# Altium schematic sheet PD_v3.SchDoc
size A4; SheetNumber: 1; SheetTotal: 1
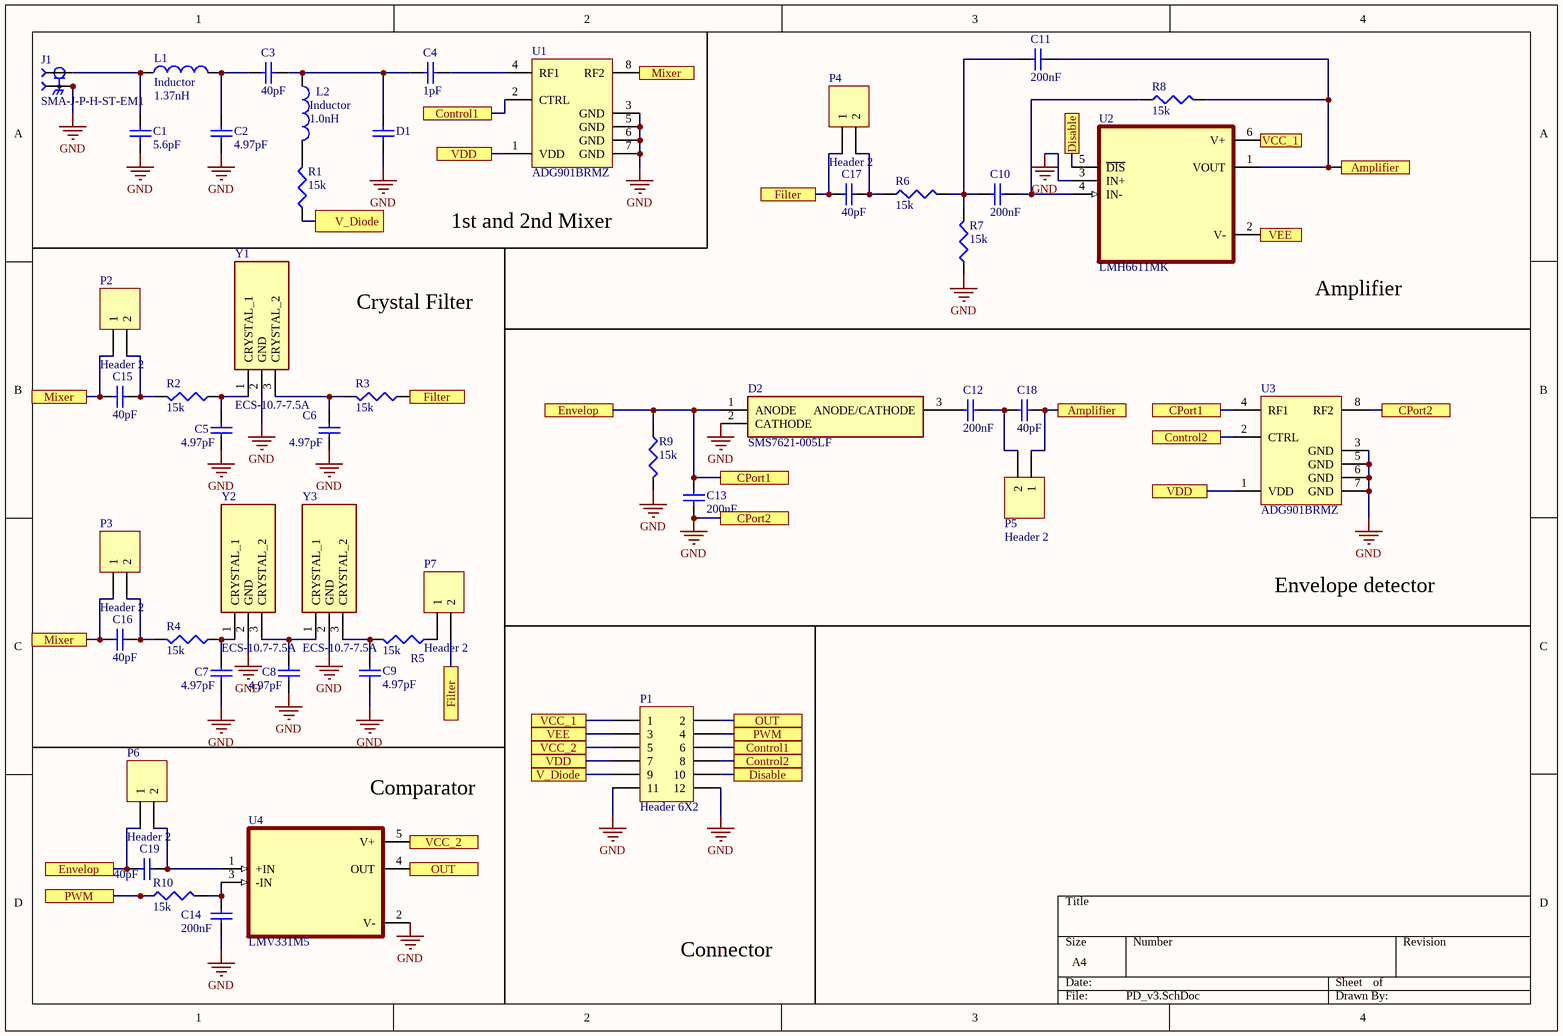
[diagram p0: PD_v3.SchDoc]

## Parts
C1  value 5.6pF  [6-0805_N]  (hidden comment: 陶瓷电容)
C2  value 4.97pF  [6-0805_N]  (hidden comment: 陶瓷电容)
C3  value 40pF  [6-0805_N]  (hidden comment: 陶瓷电容)
C4  value 1pF  [6-0805_N]  (hidden comment: 陶瓷电容)
C5  value 4.97pF  [6-0805_N]  (hidden comment: 陶瓷电容)
C6  value 4.97pF  [6-0805_N]  (hidden comment: 陶瓷电容)
C7  value 4.97pF  [6-0805_N]  (hidden comment: 陶瓷电容)
C8  value 4.97pF  [6-0805_N]  (hidden comment: 陶瓷电容)
C9  value 4.97pF  [6-0805_N]  (hidden comment: 陶瓷电容)
C10  value 200nF  [6-0805_N]  (hidden comment: 陶瓷电容)
C11  value 200nF  [6-0805_N]  (hidden comment: 陶瓷电容)
C12  value 200nF  [6-0805_N]  (hidden comment: 陶瓷电容)
C13  value 200nF  [6-0805_N]  (hidden comment: 陶瓷电容)
C14  value 200nF  [6-0805_N]  (hidden comment: 陶瓷电容)
C15  value 40pF  [0603]  (hidden comment: 陶瓷电容)
C16  value 40pF  [0603]  (hidden comment: 陶瓷电容)
C17  value 40pF  [0603]  (hidden comment: 陶瓷电容)
C18  value 40pF  [0603]  (hidden comment: 陶瓷电容)
C19  value 40pF  [0603]  (hidden comment: 陶瓷电容)
D1  陶瓷电容  [6-0805_N]  (value not drawn)
D2  SMS7621-005LF  [SOT95P237X112-3N]
J1  SMA-J-P-H-ST-EM1  [SAMTEC_SMA-J-P-H-ST-EM1]
L1  Inductor  value 1.37nH  [6-0805_N]
L2  Inductor  value 1.0nH  [6-0805_N]
P1  Header 6X2  [HDR2X6]
P2  Header 2  [HDR1X2]
P3  Header 2  [HDR1X2]
P4  Header 2  [HDR1X2]
P5  Header 2  [HDR1X2]
P6  Header 2  [HDR1X2]
P7  Header 2  [HDR1X2]
R1  value 15k  [6-0805_N]  (hidden comment: 电阻)
R2  value 15k  [6-0805_N]  (hidden comment: 电阻)
R3  value 15k  [6-0805_N]  (hidden comment: 电阻)
R4  value 15k  [6-0805_N]  (hidden comment: 电阻)
R5  value 15k  [6-0805_N]  (hidden comment: 电阻)
R6  value 15k  [6-0805_N]  (hidden comment: 电阻)
R7  value 15k  [6-0805_N]  (hidden comment: 电阻)
R8  value 15k  [6-0805_N]  (hidden comment: 电阻)
R9  value 15k  [6-0805_N]  (hidden comment: 电阻)
R10  value 15k  [6-0805_N]  (hidden comment: 电阻)
U1  ADG901BRMZ  [SOP65P490X110-8N]
U2  LMH6611MK  [SOT95P280X110-6N]
U3  ADG901BRMZ  [SOP65P490X110-8N]
U4  LMV331M5  [SOT95P280X145-5N]
Y1  ECS-10.7-7.5A  [ECS10775A]
Y2  ECS-10.7-7.5A  [ECS10775A]
Y3  ECS-10.7-7.5A  [ECS10775A]

## Ports
Amplifier, Control1, Control2, CPort1, CPort2, Disable, Envelop, Filter, Mixer, OUT, PWM, V_Diode, VCC_1, VCC_2, VDD, VEE

## Nets
GND: C1.1 C2.1 C5.1 C6.1 C7.1 C8.1 C9.1 C13.2 C14.2 D1.1 D2.2(CATHODE) J1.2_1 J1.2_2 J1.3_1 J1.3_2 P1.11 P1.12 R7.1 R9.1 U1.3(GND) U1.5(GND) U1.6(GND) U1.7(GND) U2.3(IN+) U3.3(GND) U3.5(GND) U3.6(GND) U3.7(GND) U3.8(RF2) U4.2(V-) Y1.2(GND) Y2.2(GND) Y3.2(GND) ; port CPort2
Amplifier: C11.2 C18.2 P5.1 R8.2 U2.1(VOUT) ; port Amplifier
Control1: P1.6 U1.2(CTRL) ; port Control1
Control2: P1.8 U3.2(CTRL) ; port Control2
CPort1: C13.1 C19.1 D2.1(ANODE) P6.1 R9.2 U3.4(RF1) ; port CPort1, port Envelop
Disable: P1.10 U2.5(~{DIS}) ; port Disable
Filter: C17.1 P4.1 P7.2 R3.1 ; port Filter
Mixer: C15.1 C16.1 P2.1 P3.1 U1.8(RF2) ; port Mixer
OUT: P1.2 U4.4(OUT) ; port OUT
PWM: P1.4 R10.2 ; port PWM
V_Diode: P1.9 R1.1 ; port V_Diode
VCC_1: P1.1 U2.6(V+) ; port VCC_1
VCC_2: P1.5 U4.5(V+) ; port VCC_2
VDD: P1.7 U1.1(VDD) U3.1(VDD) ; port VDD
VEE: P1.3 U2.2(V-) ; port VEE
NetC1_2: C1.2 J1.1 L1.1
NetC2_2: C2.2 C3.1 L1.2
NetC3_2: C3.2 C4.1 D1.2 L2.1
NetC4_2: C4.2 U1.4(RF1)
NetC5_2: C5.2 R2.1 Y1.1(CRYSTAL_1)
NetC6_2: C6.2 R3.2 Y1.3(CRYSTAL_2)
NetC7_2: C7.2 R4.1 Y2.1(CRYSTAL_1)
NetC8_2: C8.2 Y2.3(CRYSTAL_2) Y3.1(CRYSTAL_1)
NetC9_2: C9.2 R5.2 Y3.3(CRYSTAL_2)
NetC10_1: C10.1 C11.1 R6.2 R7.2
NetC10_2: C10.2 R8.1 U2.4(IN-)
NetC12_1: C12.1 D2.3(ANODE/CATHODE)
NetC12_2: C12.2 C18.1 P5.2
NetC14_1: C14.1 R10.1 U4.3(-IN)
NetC15_2: C15.2 P2.2 R2.2
NetC16_2: C16.2 P3.2 R4.2
NetC17_2: C17.2 P4.2 R6.1
NetC19_2: C19.2 P6.2 U4.1(+IN)
NetL2_2: L2.2 R1.2
NetP7_1: P7.1 R5.1

## Notes on the sheet
- 1st and 2nd Mixer
- Crystal Filter
- Amplifier
- Envelope detector
- (near U4) Comparator
- Connector

## Library data of the parts
C1-C19 D1 = 陶瓷电容: Capacitor (Semiconductor SIM Model); Published: 8-Jun-2000; LatestRevisionDate: 29-May-2009; LatestRevisionNote: IPC-7351 Footprint Added.; PackageReference: C1206; Publisher: Altium Limited; PackageDescription: Chip Capacitor
D2 = SMS7621-005LF: Schottky Diode; Manufacturer_Name: Skyworks; Datasheet Link: http://www.skyworksinc.com/uploads/documents/Surface_Mount_Schottky_Diodes_200041AD.pdf; Height: 1.12mm; Manufacturer_Part_Number: SMS7621-005LF; Mouser Part Number: 873-SMS7621-005LF; Mouser Price/Stock: https://www.mouser.co.uk/ProductDetail/Skyworks-Solutions-Inc/SMS7621-005LF?qs=WMHGlxXAKT%252Bjr6kEDDbbkQ%3D%3D
J1 = SMA-J-P-H-ST-EM1: SMA Connector Jack, Female Socket 50Ohm Board Edge, End Launch Solder; MF: Samtec; SnapEDA_Link: https://www.snapeda.com/parts/SMA-J-P-H-ST-EM1/Samtec%20Inc./view-part/134500/?ref=snap; MP: SMA-J-P-H-ST-EM1; Toby_UK-Purchase-URL: https://snapeda.com/shop?store=Toby+UK&id=134500; Value: *; Package: None; Digi-Key_Part_Number: SAM8857-ND
L1 L2 = Inductor: Code_IEC: 1005; Published: 8-Jun-2000; LatestRevisionDate: 29-May-2009; LatestRevisionNote: IPC-7351 Footprint Added.; PackageReference: 0402-A; Publisher: Altium Limited; PackageDescription: Chip Inductor; Code_JEITA: 0402
P1 = Header 6X2: Header, 6-Pin, Dual row; LatestRevisionDate: 17-Jul-2002; LatestRevisionNote: Re-released for DXP Platform.; Publisher: Altium Limited
P2-P7 = Header 2: Header, 2-Pin; LatestRevisionDate: 17-Jul-2002; LatestRevisionNote: Re-released for DXP Platform.; Publisher: Altium Limited
R1-R10 = 电阻: Resistor; Published: 8-Jun-2000; LatestRevisionDate: 29-May-2009; LatestRevisionNote: IPC-7351 Footprint Added.; PackageReference: J1-0603; Publisher: Altium Limited; PackageDescription: Chip Resistor
U1 U3 = ADG901BRMZ: RF Switch, Wideband, 40 dB Isolation at 1 GHz, CMOS 1.65 V to 2.75 V, SPST Switches, RM-8, Pb-Free, 50 Tube; Configuration: SPST/NO; # Sw Functions: 1; Supply Voltage: Single (+1.65V to +2.75V); Insertion Loss (dB): 800mdB; Bandwidth: 4.5GHz; P-1dB (dBm): 17; Off Isolation: 37dB; Off Isolation Test Freq: 1G; DatasheetVersion: RevB; PackageVersion: Aug-2005; PackageReference: RM-8; PackageDescription: 8-Lead Mini Small Outline Package [MSOP]; Code_JEDEC: MO-187-AA; ComponentLink1Description: Manufacturer URL; ComponentLink1URL: www.analog.com; ComponentLink2Description: Datasheet; ComponentLink2URL: http://www.analog.com/static/imported-files/data_sheets/ADG901_902.pdf; ComponentLink3Description: Package Specification; ComponentLink3URL: http://www.analog.com/static/imported-files/packages/PKG_PDF/MSOP%28RM%29/RM_8.pdf
U2 = LMH6611MK: MF: {'manufacturer': u'Texas Instruments'}; MP: LMH6611MK/NOPB; Package: None; Price: None; Value: *; Availability: Unavailable
U4 = LMV331M5: MF: {'manufacturer': u'Texas Instruments'}; MP: LMV331M5/NOPB; Price: None; Availability: Unavailable; Value: *; Package: None
Y1-Y3 = ECS-10.7-7.5A: Crystal or Oscillator; Manufacturer_Name: ECS; Datasheet Link: http://www.ecsxtal.com/store/pdf/mono crystal filters.pdf; Height: 11.2mm; Manufacturer_Part_Number: ECS-10.7-7.5A; Mouser Part Number: 520-107-7.5A; Mouser Price/Stock: https://www.mouser.co.uk/ProductDetail/ECS/ECS-107-75A?qs=A5Qiz0JZgg4zSHI1UHphaA%3D%3D; Arrow Part Number: ECS-10.7-7.5A; Arrow Price/Stock: https://www.arrow.com/en/products/ecs-10.7-7.5a/ecs-international